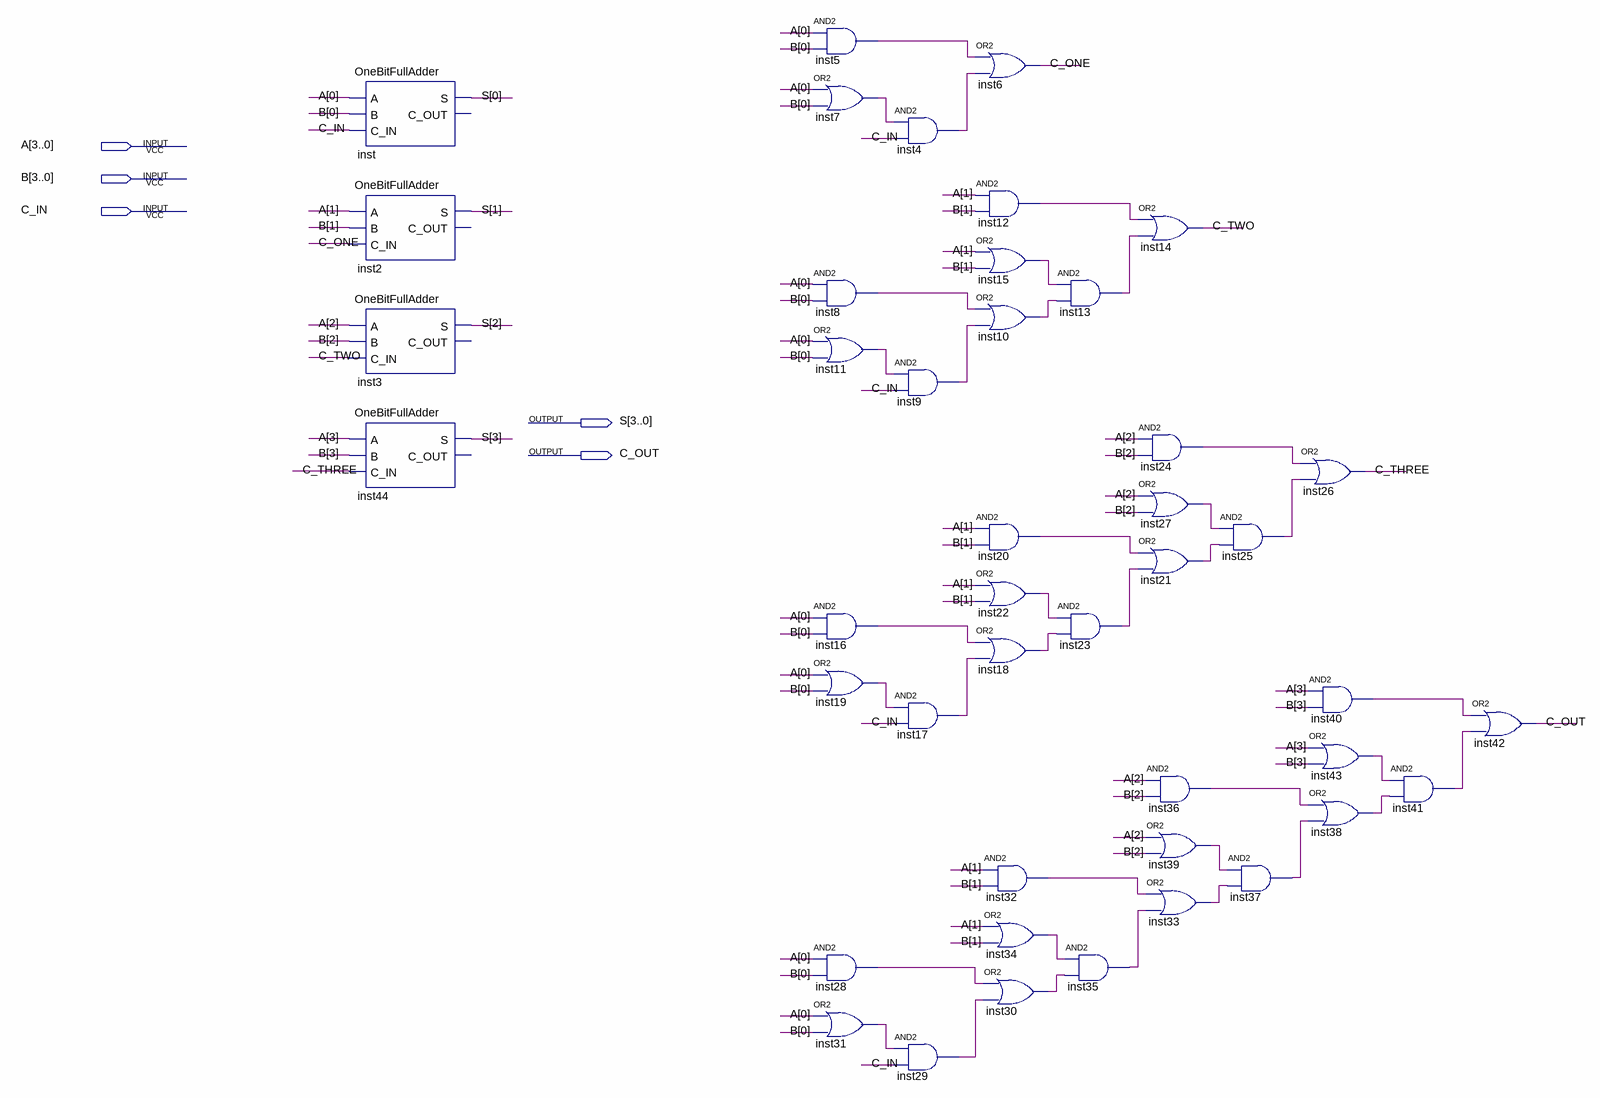
[diagram p0: schematic sheet]
// Quartus schematic FourBitCarryLookaheadAdder.bdf as structural Verilog: 44 symbols, 5 pins
module FourBitCarryLookaheadAdder (
  input  [3:0] A,
  input  [3:0] B,
  input  C_IN,
  output [3:0] S,
  output C_OUT
);

  wire C_ONE, C_THREE, C_TWO, inst4_out, inst5_out, inst7_out, inst8_out, inst9_out, inst10_out, inst11_out,
       inst12_out, inst13_out, inst15_out, inst16_out, inst17_out, inst18_out, inst19_out, inst20_out,
       inst21_out, inst22_out, inst23_out, inst24_out, inst25_out, inst27_out, inst28_out, inst29_out,
       inst30_out, inst31_out, inst32_out, inst33_out, inst34_out, inst35_out, inst36_out, inst37_out,
       inst38_out, inst39_out, inst40_out, inst41_out, inst43_out;

  OneBitFullAdder inst (.A(A[0]), .B(B[0]), .C_IN(C_IN), .S(S[0]));  // open: C_OUT
  OneBitFullAdder inst2 (.A(A[1]), .B(B[1]), .C_IN(C_ONE), .S(S[1]));  // open: C_OUT
  OneBitFullAdder inst3 (.A(A[2]), .B(B[2]), .C_IN(C_TWO), .S(S[2]));  // open: C_OUT
  OneBitFullAdder inst44 (.A(A[3]), .B(B[3]), .C_IN(C_THREE), .S(S[3]));  // open: C_OUT
  and inst5 (inst5_out, A[0], B[0]);
  or inst7 (inst7_out, A[0], B[0]);
  and inst8 (inst8_out, A[0], B[0]);
  or inst11 (inst11_out, A[0], B[0]);
  and inst16 (inst16_out, A[0], B[0]);
  or inst19 (inst19_out, A[0], B[0]);
  and inst28 (inst28_out, A[0], B[0]);
  or inst31 (inst31_out, A[0], B[0]);
  and inst4 (inst4_out, inst7_out, C_IN);
  and inst9 (inst9_out, inst11_out, C_IN);
  and inst17 (inst17_out, inst19_out, C_IN);
  and inst29 (inst29_out, inst31_out, C_IN);
  or inst6 (C_ONE, inst5_out, inst4_out);
  and inst12 (inst12_out, A[1], B[1]);
  or inst15 (inst15_out, A[1], B[1]);
  or inst10 (inst10_out, inst8_out, inst9_out);
  and inst20 (inst20_out, A[1], B[1]);
  or inst22 (inst22_out, A[1], B[1]);
  or inst18 (inst18_out, inst16_out, inst17_out);
  and inst32 (inst32_out, A[1], B[1]);
  or inst34 (inst34_out, A[1], B[1]);
  or inst30 (inst30_out, inst28_out, inst29_out);
  and inst13 (inst13_out, inst15_out, inst10_out);
  and inst23 (inst23_out, inst22_out, inst18_out);
  and inst35 (inst35_out, inst34_out, inst30_out);
  or inst14 (C_TWO, inst12_out, inst13_out);
  and inst24 (inst24_out, A[2], B[2]);
  or inst27 (inst27_out, A[2], B[2]);
  or inst21 (inst21_out, inst20_out, inst23_out);
  and inst36 (inst36_out, A[2], B[2]);
  or inst39 (inst39_out, A[2], B[2]);
  or inst33 (inst33_out, inst32_out, inst35_out);
  and inst25 (inst25_out, inst27_out, inst21_out);
  and inst37 (inst37_out, inst39_out, inst33_out);
  or inst26 (C_THREE, inst24_out, inst25_out);
  and inst40 (inst40_out, A[3], B[3]);
  or inst43 (inst43_out, A[3], B[3]);
  or inst38 (inst38_out, inst36_out, inst37_out);
  and inst41 (inst41_out, inst43_out, inst38_out);
  or inst42 (C_OUT, inst40_out, inst41_out);
endmodule
